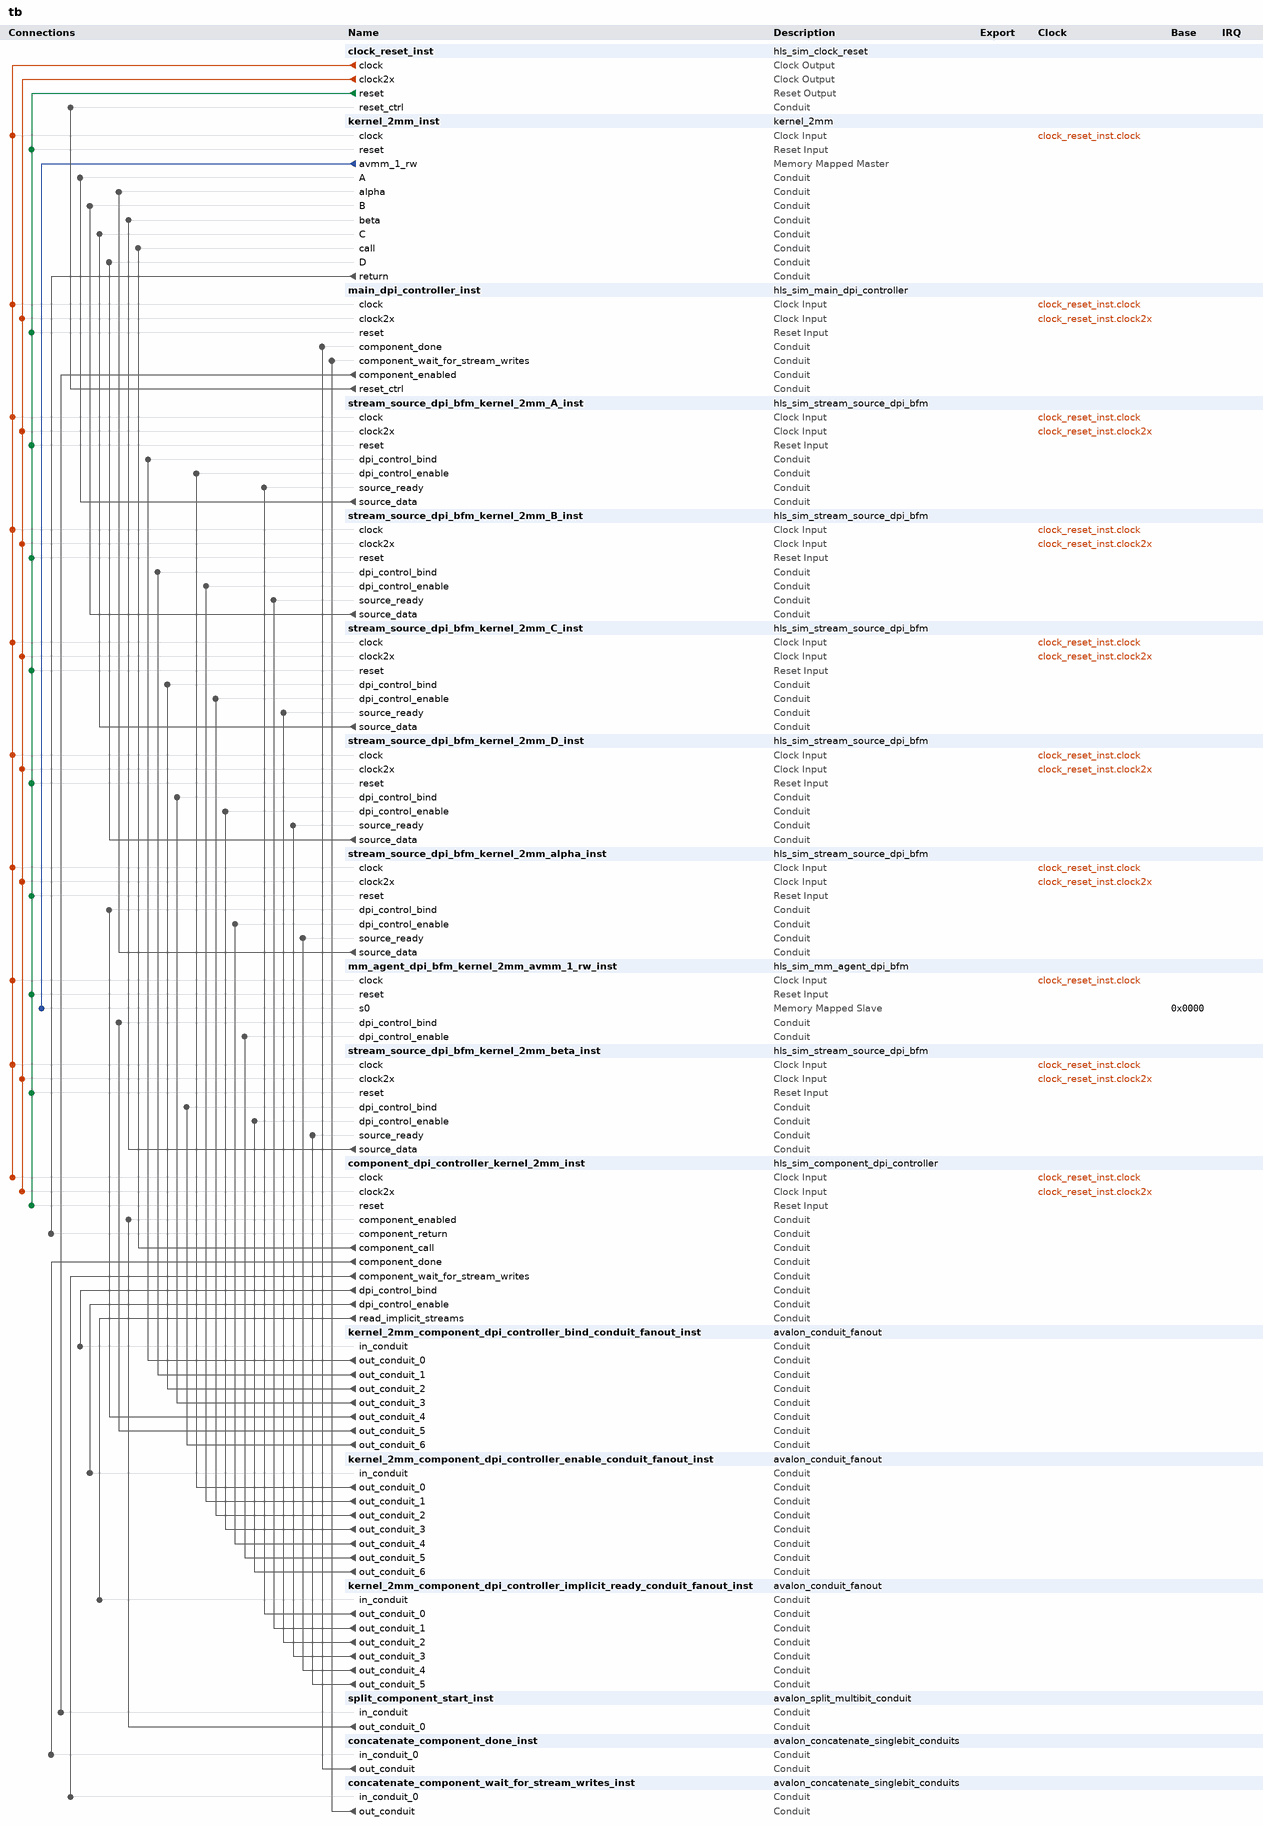
[diagram p0: system contents]
# Platform Designer (Qsys) system tb, Cyclone V 5CGXFC3B6F23C6
# Parameters at their usual value, and those the tool derives, are not listed.
package require qsys
create_system tb
set_project_property DEVICE_FAMILY {Cyclone V}
set_project_property DEVICE 5CGXFC3B6F23C6

add_instance clock_reset_inst hls_sim_clock_reset 1.0
set_instance_parameter_value clock_reset_inst RESET_CYCLE_HOLD 4

add_instance kernel_2mm_inst kernel_2mm 1.0

add_instance main_dpi_controller_inst hls_sim_main_dpi_controller 1.0
set_instance_parameter_value main_dpi_controller_inst COMPONENT_NAMES_STR kernel_2mm
set_instance_parameter_value main_dpi_controller_inst NUM_COMPONENTS 1

add_instance stream_source_dpi_bfm_kernel_2mm_A_inst hls_sim_stream_source_dpi_bfm 1.0
set_instance_parameter_value stream_source_dpi_bfm_kernel_2mm_A_inst COMPONENT_NAME kernel_2mm
set_instance_parameter_value stream_source_dpi_bfm_kernel_2mm_A_inst EMPTY_WIDTH 0
set_instance_parameter_value stream_source_dpi_bfm_kernel_2mm_A_inst FIRST_SYMBOL_IN_HIGH_ORDER_BITS 0
set_instance_parameter_value stream_source_dpi_bfm_kernel_2mm_A_inst FORCE_STREAM_CONDUIT 1
set_instance_parameter_value stream_source_dpi_bfm_kernel_2mm_A_inst INTERFACE_NAME A
set_instance_parameter_value stream_source_dpi_bfm_kernel_2mm_A_inst STREAM_BITSPERSYMBOL 1
set_instance_parameter_value stream_source_dpi_bfm_kernel_2mm_A_inst STREAM_DATAWIDTH 64
set_instance_parameter_value stream_source_dpi_bfm_kernel_2mm_A_inst USES_PACKETS 0

add_instance stream_source_dpi_bfm_kernel_2mm_B_inst hls_sim_stream_source_dpi_bfm 1.0
set_instance_parameter_value stream_source_dpi_bfm_kernel_2mm_B_inst COMPONENT_NAME kernel_2mm
set_instance_parameter_value stream_source_dpi_bfm_kernel_2mm_B_inst EMPTY_WIDTH 0
set_instance_parameter_value stream_source_dpi_bfm_kernel_2mm_B_inst FIRST_SYMBOL_IN_HIGH_ORDER_BITS 0
set_instance_parameter_value stream_source_dpi_bfm_kernel_2mm_B_inst FORCE_STREAM_CONDUIT 1
set_instance_parameter_value stream_source_dpi_bfm_kernel_2mm_B_inst INTERFACE_NAME B
set_instance_parameter_value stream_source_dpi_bfm_kernel_2mm_B_inst STREAM_BITSPERSYMBOL 1
set_instance_parameter_value stream_source_dpi_bfm_kernel_2mm_B_inst STREAM_DATAWIDTH 64
set_instance_parameter_value stream_source_dpi_bfm_kernel_2mm_B_inst USES_PACKETS 0

add_instance stream_source_dpi_bfm_kernel_2mm_C_inst hls_sim_stream_source_dpi_bfm 1.0
set_instance_parameter_value stream_source_dpi_bfm_kernel_2mm_C_inst COMPONENT_NAME kernel_2mm
set_instance_parameter_value stream_source_dpi_bfm_kernel_2mm_C_inst EMPTY_WIDTH 0
set_instance_parameter_value stream_source_dpi_bfm_kernel_2mm_C_inst FIRST_SYMBOL_IN_HIGH_ORDER_BITS 0
set_instance_parameter_value stream_source_dpi_bfm_kernel_2mm_C_inst FORCE_STREAM_CONDUIT 1
set_instance_parameter_value stream_source_dpi_bfm_kernel_2mm_C_inst INTERFACE_NAME C
set_instance_parameter_value stream_source_dpi_bfm_kernel_2mm_C_inst STREAM_BITSPERSYMBOL 1
set_instance_parameter_value stream_source_dpi_bfm_kernel_2mm_C_inst STREAM_DATAWIDTH 64
set_instance_parameter_value stream_source_dpi_bfm_kernel_2mm_C_inst USES_PACKETS 0

add_instance stream_source_dpi_bfm_kernel_2mm_D_inst hls_sim_stream_source_dpi_bfm 1.0
set_instance_parameter_value stream_source_dpi_bfm_kernel_2mm_D_inst COMPONENT_NAME kernel_2mm
set_instance_parameter_value stream_source_dpi_bfm_kernel_2mm_D_inst EMPTY_WIDTH 0
set_instance_parameter_value stream_source_dpi_bfm_kernel_2mm_D_inst FIRST_SYMBOL_IN_HIGH_ORDER_BITS 0
set_instance_parameter_value stream_source_dpi_bfm_kernel_2mm_D_inst FORCE_STREAM_CONDUIT 1
set_instance_parameter_value stream_source_dpi_bfm_kernel_2mm_D_inst INTERFACE_NAME D
set_instance_parameter_value stream_source_dpi_bfm_kernel_2mm_D_inst STREAM_BITSPERSYMBOL 1
set_instance_parameter_value stream_source_dpi_bfm_kernel_2mm_D_inst STREAM_DATAWIDTH 64
set_instance_parameter_value stream_source_dpi_bfm_kernel_2mm_D_inst USES_PACKETS 0

add_instance stream_source_dpi_bfm_kernel_2mm_alpha_inst hls_sim_stream_source_dpi_bfm 1.0
set_instance_parameter_value stream_source_dpi_bfm_kernel_2mm_alpha_inst COMPONENT_NAME kernel_2mm
set_instance_parameter_value stream_source_dpi_bfm_kernel_2mm_alpha_inst EMPTY_WIDTH 0
set_instance_parameter_value stream_source_dpi_bfm_kernel_2mm_alpha_inst FIRST_SYMBOL_IN_HIGH_ORDER_BITS 0
set_instance_parameter_value stream_source_dpi_bfm_kernel_2mm_alpha_inst FORCE_STREAM_CONDUIT 1
set_instance_parameter_value stream_source_dpi_bfm_kernel_2mm_alpha_inst INTERFACE_NAME alpha
set_instance_parameter_value stream_source_dpi_bfm_kernel_2mm_alpha_inst STREAM_BITSPERSYMBOL 1
set_instance_parameter_value stream_source_dpi_bfm_kernel_2mm_alpha_inst STREAM_DATAWIDTH 32
set_instance_parameter_value stream_source_dpi_bfm_kernel_2mm_alpha_inst USES_PACKETS 0

add_instance mm_agent_dpi_bfm_kernel_2mm_avmm_1_rw_inst hls_sim_mm_agent_dpi_bfm 1.0
set_instance_parameter_value mm_agent_dpi_bfm_kernel_2mm_avmm_1_rw_inst ADDRESS_UNITS SYMBOLS
set_instance_parameter_value mm_agent_dpi_bfm_kernel_2mm_avmm_1_rw_inst ASSERT_HIGH_ARBITERLOCK 1
set_instance_parameter_value mm_agent_dpi_bfm_kernel_2mm_avmm_1_rw_inst ASSERT_HIGH_BYTEENABLE 1
set_instance_parameter_value mm_agent_dpi_bfm_kernel_2mm_avmm_1_rw_inst ASSERT_HIGH_LOCK 1
set_instance_parameter_value mm_agent_dpi_bfm_kernel_2mm_avmm_1_rw_inst ASSERT_HIGH_READ 1
set_instance_parameter_value mm_agent_dpi_bfm_kernel_2mm_avmm_1_rw_inst ASSERT_HIGH_READDATAVALID 1
set_instance_parameter_value mm_agent_dpi_bfm_kernel_2mm_avmm_1_rw_inst ASSERT_HIGH_WAITREQUEST 1
set_instance_parameter_value mm_agent_dpi_bfm_kernel_2mm_avmm_1_rw_inst ASSERT_HIGH_WRITE 1
set_instance_parameter_value mm_agent_dpi_bfm_kernel_2mm_avmm_1_rw_inst AV_ADDRESS_W 32
set_instance_parameter_value mm_agent_dpi_bfm_kernel_2mm_avmm_1_rw_inst AV_BURSTCOUNT_W 3
set_instance_parameter_value mm_agent_dpi_bfm_kernel_2mm_avmm_1_rw_inst AV_BURST_BNDR_ONLY 1
set_instance_parameter_value mm_agent_dpi_bfm_kernel_2mm_avmm_1_rw_inst AV_BURST_LINEWRAP 1
set_instance_parameter_value mm_agent_dpi_bfm_kernel_2mm_avmm_1_rw_inst AV_FIX_READ_LATENCY 1
set_instance_parameter_value mm_agent_dpi_bfm_kernel_2mm_avmm_1_rw_inst AV_MAX_PENDING_READS 0
set_instance_parameter_value mm_agent_dpi_bfm_kernel_2mm_avmm_1_rw_inst AV_MAX_PENDING_WRITES 0
set_instance_parameter_value mm_agent_dpi_bfm_kernel_2mm_avmm_1_rw_inst AV_NUMSYMBOLS 4
set_instance_parameter_value mm_agent_dpi_bfm_kernel_2mm_avmm_1_rw_inst AV_READRESPONSE_W 8
set_instance_parameter_value mm_agent_dpi_bfm_kernel_2mm_avmm_1_rw_inst AV_READ_WAIT_TIME 0
set_instance_parameter_value mm_agent_dpi_bfm_kernel_2mm_avmm_1_rw_inst AV_REGISTERINCOMINGSIGNALS 0
set_instance_parameter_value mm_agent_dpi_bfm_kernel_2mm_avmm_1_rw_inst AV_SYMBOL_W 8
set_instance_parameter_value mm_agent_dpi_bfm_kernel_2mm_avmm_1_rw_inst AV_WRITERESPONSE_W 8
set_instance_parameter_value mm_agent_dpi_bfm_kernel_2mm_avmm_1_rw_inst AV_WRITE_WAIT_TIME 0
set_instance_parameter_value mm_agent_dpi_bfm_kernel_2mm_avmm_1_rw_inst COMPONENT_NAME kernel_2mm
set_instance_parameter_value mm_agent_dpi_bfm_kernel_2mm_avmm_1_rw_inst INTERFACE_ID 1
set_instance_parameter_value mm_agent_dpi_bfm_kernel_2mm_avmm_1_rw_inst REGISTER_WAITREQUEST 0
set_instance_parameter_value mm_agent_dpi_bfm_kernel_2mm_avmm_1_rw_inst USE_ADDRESS 1
set_instance_parameter_value mm_agent_dpi_bfm_kernel_2mm_avmm_1_rw_inst USE_ARBITERLOCK 0
set_instance_parameter_value mm_agent_dpi_bfm_kernel_2mm_avmm_1_rw_inst USE_BEGIN_BURST_TRANSFER 0
set_instance_parameter_value mm_agent_dpi_bfm_kernel_2mm_avmm_1_rw_inst USE_BEGIN_TRANSFER 0
set_instance_parameter_value mm_agent_dpi_bfm_kernel_2mm_avmm_1_rw_inst USE_BURSTCOUNT 0
set_instance_parameter_value mm_agent_dpi_bfm_kernel_2mm_avmm_1_rw_inst USE_BYTE_ENABLE 1
set_instance_parameter_value mm_agent_dpi_bfm_kernel_2mm_avmm_1_rw_inst USE_CLKEN 0
set_instance_parameter_value mm_agent_dpi_bfm_kernel_2mm_avmm_1_rw_inst USE_DEBUGACCESS 0
set_instance_parameter_value mm_agent_dpi_bfm_kernel_2mm_avmm_1_rw_inst USE_LOCK 0
set_instance_parameter_value mm_agent_dpi_bfm_kernel_2mm_avmm_1_rw_inst USE_READ 1
set_instance_parameter_value mm_agent_dpi_bfm_kernel_2mm_avmm_1_rw_inst USE_READ_DATA 1
set_instance_parameter_value mm_agent_dpi_bfm_kernel_2mm_avmm_1_rw_inst USE_READ_DATA_VALID 0
set_instance_parameter_value mm_agent_dpi_bfm_kernel_2mm_avmm_1_rw_inst USE_WAIT_REQUEST 0
set_instance_parameter_value mm_agent_dpi_bfm_kernel_2mm_avmm_1_rw_inst USE_WRITE 1
set_instance_parameter_value mm_agent_dpi_bfm_kernel_2mm_avmm_1_rw_inst USE_WRITE_DATA 1

add_instance stream_source_dpi_bfm_kernel_2mm_beta_inst hls_sim_stream_source_dpi_bfm 1.0
set_instance_parameter_value stream_source_dpi_bfm_kernel_2mm_beta_inst COMPONENT_NAME kernel_2mm
set_instance_parameter_value stream_source_dpi_bfm_kernel_2mm_beta_inst EMPTY_WIDTH 0
set_instance_parameter_value stream_source_dpi_bfm_kernel_2mm_beta_inst FIRST_SYMBOL_IN_HIGH_ORDER_BITS 0
set_instance_parameter_value stream_source_dpi_bfm_kernel_2mm_beta_inst FORCE_STREAM_CONDUIT 1
set_instance_parameter_value stream_source_dpi_bfm_kernel_2mm_beta_inst INTERFACE_NAME beta
set_instance_parameter_value stream_source_dpi_bfm_kernel_2mm_beta_inst STREAM_BITSPERSYMBOL 1
set_instance_parameter_value stream_source_dpi_bfm_kernel_2mm_beta_inst STREAM_DATAWIDTH 32
set_instance_parameter_value stream_source_dpi_bfm_kernel_2mm_beta_inst USES_PACKETS 0

add_instance component_dpi_controller_kernel_2mm_inst hls_sim_component_dpi_controller 1.0
set_instance_parameter_value component_dpi_controller_kernel_2mm_inst COMPONENT_HAS_AGENT_RETURN 0
set_instance_parameter_value component_dpi_controller_kernel_2mm_inst COMPONENT_MANGLED_NAME "\\3fkernel_2mm@@YAXHHAEAV\\3f\$mm_host@HU\\3f\$dwidth@\$0CA@@ihc@@U\\3f\$awidth@\$0CA@@2@U\\3f\$latency@\$00@2@@ihc@@000@Z"
set_instance_parameter_value component_dpi_controller_kernel_2mm_inst COMPONENT_NAME kernel_2mm
set_instance_parameter_value component_dpi_controller_kernel_2mm_inst COMPONENT_NUM_AGENTS 0
set_instance_parameter_value component_dpi_controller_kernel_2mm_inst COMPONENT_NUM_OUTPUT_STREAMS 0
set_instance_parameter_value component_dpi_controller_kernel_2mm_inst RETURN_DATAWIDTH 64

add_instance kernel_2mm_component_dpi_controller_bind_conduit_fanout_inst avalon_conduit_fanout 1.0
set_instance_parameter_value kernel_2mm_component_dpi_controller_bind_conduit_fanout_inst numFanOut 7

add_instance kernel_2mm_component_dpi_controller_enable_conduit_fanout_inst avalon_conduit_fanout 1.0
set_instance_parameter_value kernel_2mm_component_dpi_controller_enable_conduit_fanout_inst numFanOut 7

add_instance kernel_2mm_component_dpi_controller_implicit_ready_conduit_fanout_inst avalon_conduit_fanout 1.0
set_instance_parameter_value kernel_2mm_component_dpi_controller_implicit_ready_conduit_fanout_inst numFanOut 6

add_instance split_component_start_inst avalon_split_multibit_conduit 1.0
set_instance_parameter_value split_component_start_inst multibit_width 1

add_instance concatenate_component_done_inst avalon_concatenate_singlebit_conduits 1.0
set_instance_parameter_value concatenate_component_done_inst multibit_width 1

add_instance concatenate_component_wait_for_stream_writes_inst avalon_concatenate_singlebit_conduits 1.0
set_instance_parameter_value concatenate_component_wait_for_stream_writes_inst multibit_width 1

# connections
add_connection clock_reset_inst.clock component_dpi_controller_kernel_2mm_inst.clock clock
add_connection clock_reset_inst.clock kernel_2mm_inst.clock clock
add_connection clock_reset_inst.clock main_dpi_controller_inst.clock clock
add_connection clock_reset_inst.clock mm_agent_dpi_bfm_kernel_2mm_avmm_1_rw_inst.clock clock
add_connection clock_reset_inst.clock stream_source_dpi_bfm_kernel_2mm_A_inst.clock clock
add_connection clock_reset_inst.clock stream_source_dpi_bfm_kernel_2mm_alpha_inst.clock clock
add_connection clock_reset_inst.clock stream_source_dpi_bfm_kernel_2mm_B_inst.clock clock
add_connection clock_reset_inst.clock stream_source_dpi_bfm_kernel_2mm_beta_inst.clock clock
add_connection clock_reset_inst.clock stream_source_dpi_bfm_kernel_2mm_C_inst.clock clock
add_connection clock_reset_inst.clock stream_source_dpi_bfm_kernel_2mm_D_inst.clock clock
add_connection clock_reset_inst.clock2x component_dpi_controller_kernel_2mm_inst.clock2x clock
add_connection clock_reset_inst.clock2x main_dpi_controller_inst.clock2x clock
add_connection clock_reset_inst.clock2x stream_source_dpi_bfm_kernel_2mm_A_inst.clock2x clock
add_connection clock_reset_inst.clock2x stream_source_dpi_bfm_kernel_2mm_alpha_inst.clock2x clock
add_connection clock_reset_inst.clock2x stream_source_dpi_bfm_kernel_2mm_B_inst.clock2x clock
add_connection clock_reset_inst.clock2x stream_source_dpi_bfm_kernel_2mm_beta_inst.clock2x clock
add_connection clock_reset_inst.clock2x stream_source_dpi_bfm_kernel_2mm_C_inst.clock2x clock
add_connection clock_reset_inst.clock2x stream_source_dpi_bfm_kernel_2mm_D_inst.clock2x clock
add_connection clock_reset_inst.reset component_dpi_controller_kernel_2mm_inst.reset reset
add_connection clock_reset_inst.reset kernel_2mm_inst.reset reset
add_connection clock_reset_inst.reset main_dpi_controller_inst.reset reset
add_connection clock_reset_inst.reset mm_agent_dpi_bfm_kernel_2mm_avmm_1_rw_inst.reset reset
add_connection clock_reset_inst.reset stream_source_dpi_bfm_kernel_2mm_A_inst.reset reset
add_connection clock_reset_inst.reset stream_source_dpi_bfm_kernel_2mm_alpha_inst.reset reset
add_connection clock_reset_inst.reset stream_source_dpi_bfm_kernel_2mm_B_inst.reset reset
add_connection clock_reset_inst.reset stream_source_dpi_bfm_kernel_2mm_beta_inst.reset reset
add_connection clock_reset_inst.reset stream_source_dpi_bfm_kernel_2mm_C_inst.reset reset
add_connection clock_reset_inst.reset stream_source_dpi_bfm_kernel_2mm_D_inst.reset reset
add_connection kernel_2mm_inst.avmm_1_rw mm_agent_dpi_bfm_kernel_2mm_avmm_1_rw_inst.s0 avalon
set_connection_parameter_value kernel_2mm_inst.avmm_1_rw/mm_agent_dpi_bfm_kernel_2mm_avmm_1_rw_inst.s0 baseAddress 0x0000
add_connection component_dpi_controller_kernel_2mm_inst.component_call kernel_2mm_inst.call conduit
add_connection component_dpi_controller_kernel_2mm_inst.component_done concatenate_component_done_inst.in_conduit_0 conduit
add_connection component_dpi_controller_kernel_2mm_inst.component_wait_for_stream_writes concatenate_component_wait_for_stream_writes_inst.in_conduit_0 conduit
add_connection component_dpi_controller_kernel_2mm_inst.dpi_control_bind kernel_2mm_component_dpi_controller_bind_conduit_fanout_inst.in_conduit conduit
add_connection component_dpi_controller_kernel_2mm_inst.dpi_control_enable kernel_2mm_component_dpi_controller_enable_conduit_fanout_inst.in_conduit conduit
add_connection component_dpi_controller_kernel_2mm_inst.read_implicit_streams kernel_2mm_component_dpi_controller_implicit_ready_conduit_fanout_inst.in_conduit conduit
add_connection concatenate_component_done_inst.out_conduit main_dpi_controller_inst.component_done conduit
add_connection concatenate_component_wait_for_stream_writes_inst.out_conduit main_dpi_controller_inst.component_wait_for_stream_writes conduit
add_connection kernel_2mm_component_dpi_controller_bind_conduit_fanout_inst.out_conduit_0 stream_source_dpi_bfm_kernel_2mm_A_inst.dpi_control_bind conduit
add_connection kernel_2mm_component_dpi_controller_bind_conduit_fanout_inst.out_conduit_1 stream_source_dpi_bfm_kernel_2mm_B_inst.dpi_control_bind conduit
add_connection kernel_2mm_component_dpi_controller_bind_conduit_fanout_inst.out_conduit_2 stream_source_dpi_bfm_kernel_2mm_C_inst.dpi_control_bind conduit
add_connection kernel_2mm_component_dpi_controller_bind_conduit_fanout_inst.out_conduit_3 stream_source_dpi_bfm_kernel_2mm_D_inst.dpi_control_bind conduit
add_connection kernel_2mm_component_dpi_controller_bind_conduit_fanout_inst.out_conduit_4 stream_source_dpi_bfm_kernel_2mm_alpha_inst.dpi_control_bind conduit
add_connection kernel_2mm_component_dpi_controller_bind_conduit_fanout_inst.out_conduit_5 mm_agent_dpi_bfm_kernel_2mm_avmm_1_rw_inst.dpi_control_bind conduit
add_connection kernel_2mm_component_dpi_controller_bind_conduit_fanout_inst.out_conduit_6 stream_source_dpi_bfm_kernel_2mm_beta_inst.dpi_control_bind conduit
add_connection kernel_2mm_component_dpi_controller_enable_conduit_fanout_inst.out_conduit_0 stream_source_dpi_bfm_kernel_2mm_A_inst.dpi_control_enable conduit
add_connection kernel_2mm_component_dpi_controller_enable_conduit_fanout_inst.out_conduit_1 stream_source_dpi_bfm_kernel_2mm_B_inst.dpi_control_enable conduit
add_connection kernel_2mm_component_dpi_controller_enable_conduit_fanout_inst.out_conduit_2 stream_source_dpi_bfm_kernel_2mm_C_inst.dpi_control_enable conduit
add_connection kernel_2mm_component_dpi_controller_enable_conduit_fanout_inst.out_conduit_3 stream_source_dpi_bfm_kernel_2mm_D_inst.dpi_control_enable conduit
add_connection kernel_2mm_component_dpi_controller_enable_conduit_fanout_inst.out_conduit_4 stream_source_dpi_bfm_kernel_2mm_alpha_inst.dpi_control_enable conduit
add_connection kernel_2mm_component_dpi_controller_enable_conduit_fanout_inst.out_conduit_5 mm_agent_dpi_bfm_kernel_2mm_avmm_1_rw_inst.dpi_control_enable conduit
add_connection kernel_2mm_component_dpi_controller_enable_conduit_fanout_inst.out_conduit_6 stream_source_dpi_bfm_kernel_2mm_beta_inst.dpi_control_enable conduit
add_connection kernel_2mm_component_dpi_controller_implicit_ready_conduit_fanout_inst.out_conduit_0 stream_source_dpi_bfm_kernel_2mm_A_inst.source_ready conduit
add_connection kernel_2mm_component_dpi_controller_implicit_ready_conduit_fanout_inst.out_conduit_1 stream_source_dpi_bfm_kernel_2mm_B_inst.source_ready conduit
add_connection kernel_2mm_component_dpi_controller_implicit_ready_conduit_fanout_inst.out_conduit_2 stream_source_dpi_bfm_kernel_2mm_C_inst.source_ready conduit
add_connection kernel_2mm_component_dpi_controller_implicit_ready_conduit_fanout_inst.out_conduit_3 stream_source_dpi_bfm_kernel_2mm_D_inst.source_ready conduit
add_connection kernel_2mm_component_dpi_controller_implicit_ready_conduit_fanout_inst.out_conduit_4 stream_source_dpi_bfm_kernel_2mm_alpha_inst.source_ready conduit
add_connection kernel_2mm_component_dpi_controller_implicit_ready_conduit_fanout_inst.out_conduit_5 stream_source_dpi_bfm_kernel_2mm_beta_inst.source_ready conduit
add_connection kernel_2mm_inst.return component_dpi_controller_kernel_2mm_inst.component_return conduit
add_connection main_dpi_controller_inst.component_enabled split_component_start_inst.in_conduit conduit
add_connection main_dpi_controller_inst.reset_ctrl clock_reset_inst.reset_ctrl conduit
add_connection split_component_start_inst.out_conduit_0 component_dpi_controller_kernel_2mm_inst.component_enabled conduit
add_connection stream_source_dpi_bfm_kernel_2mm_A_inst.source_data kernel_2mm_inst.A conduit
add_connection stream_source_dpi_bfm_kernel_2mm_alpha_inst.source_data kernel_2mm_inst.alpha conduit
add_connection stream_source_dpi_bfm_kernel_2mm_B_inst.source_data kernel_2mm_inst.B conduit
add_connection stream_source_dpi_bfm_kernel_2mm_beta_inst.source_data kernel_2mm_inst.beta conduit
add_connection stream_source_dpi_bfm_kernel_2mm_C_inst.source_data kernel_2mm_inst.C conduit
add_connection stream_source_dpi_bfm_kernel_2mm_D_inst.source_data kernel_2mm_inst.D conduit

set_interconnect_requirement {$system} qsys_mm.clockCrossingAdapter HANDSHAKE
set_interconnect_requirement {$system} qsys_mm.enableEccProtection FALSE
set_interconnect_requirement {$system} qsys_mm.insertDefaultSlave FALSE
set_interconnect_requirement {$system} qsys_mm.maxAdditionalLatency 1

save_system tb.qsys
